# Altium schematic sheet con-left-top.SchDoc: CS - Left Top
size Letter; CheckedBy: J. Brinton; CompanyName: Signal Laboratories, Inc.; DrawnBy: J. Brinton; Engineer: J. Brinton; Address1: 3479 Edison Way; Address2: Menlo Park CA 94025; Address3: +1 (877) 778-8435; Address4: siglabs.com; Revision: 3; SheetNumber: 33; SheetTotal: 47
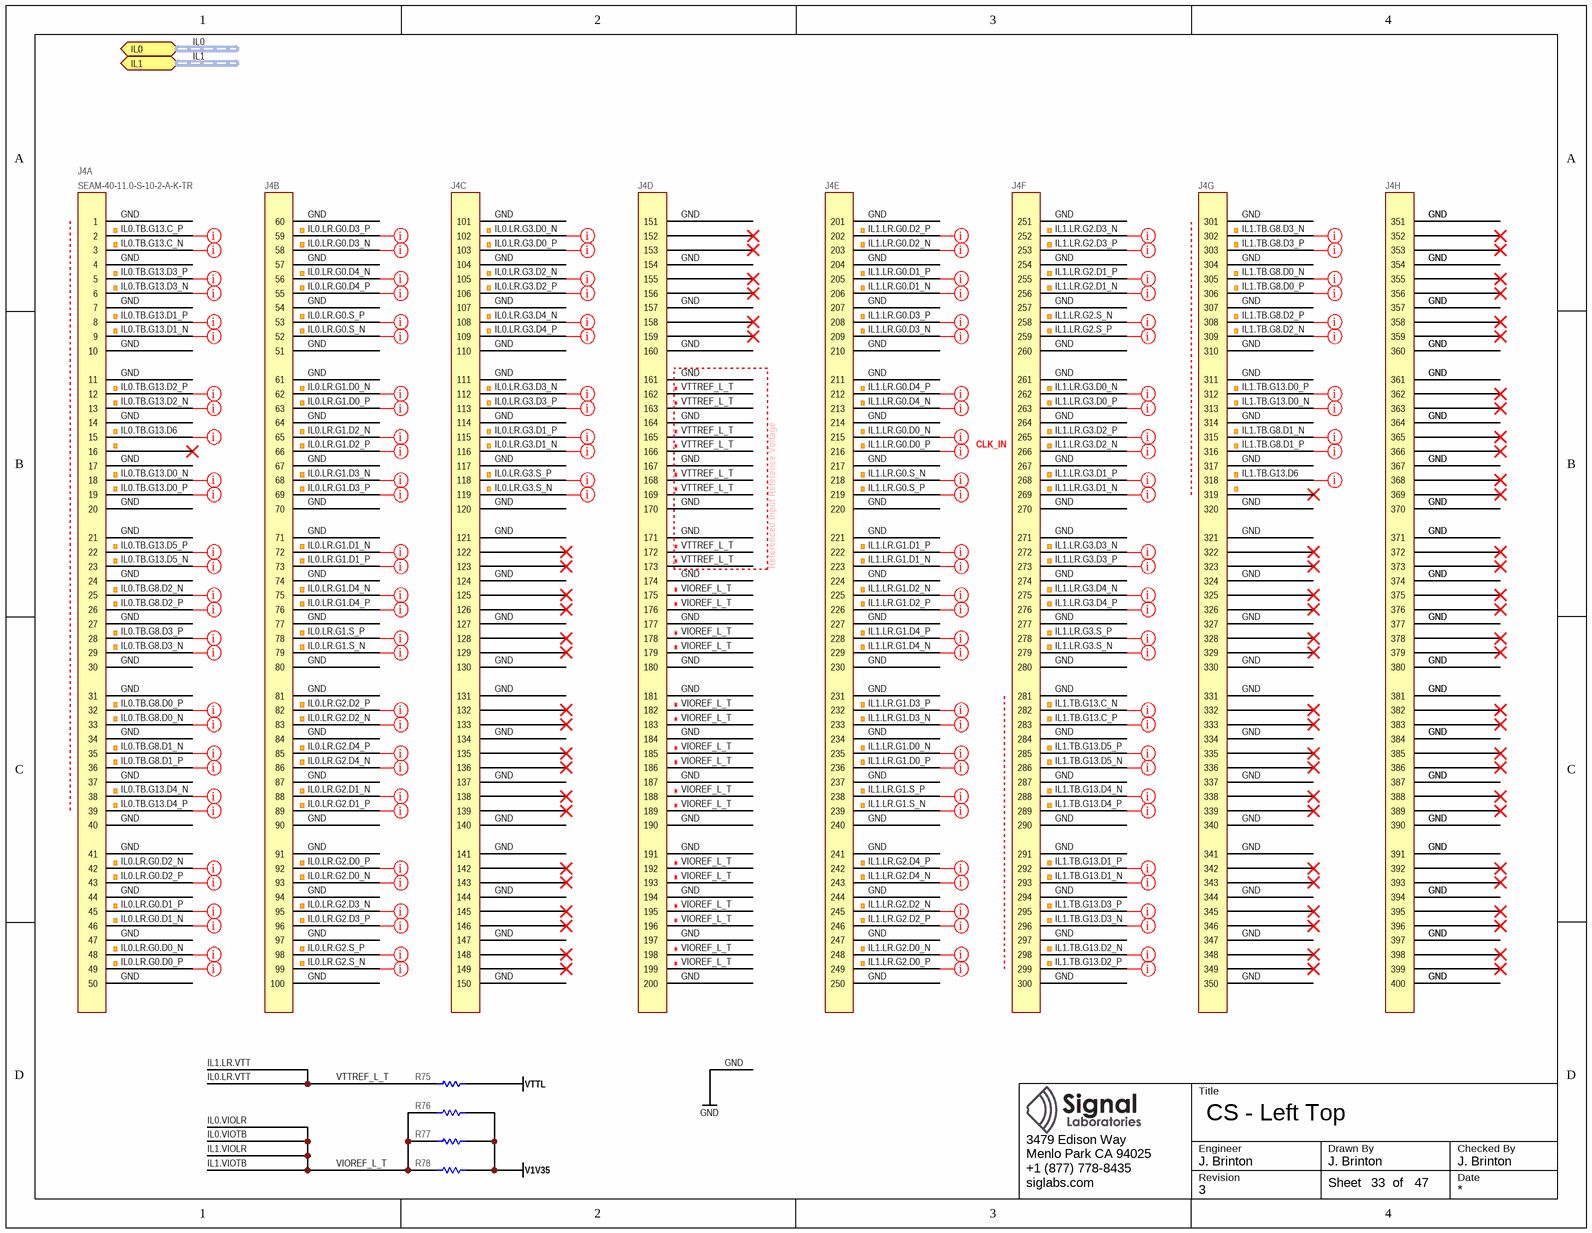
[diagram p0: con-left-top.SchDoc]

## Parts
J4  SEAM-40-11.0-S-10-2-A-K-TR  [SEAM-40-11.0-S-10-2-A-K-TR]  (parts A,B,C,D,E,F,G,H of 8)
R75  SOLDER_LINK  [SOLDERLINK0603X26N]  (value not drawn)  (no BOM)
R76  SOLDER_LINK  [SOLDERLINK0603X26N]  (value not drawn)  (no BOM)
R77  SOLDER_LINK  [SOLDERLINK0603X26N]  (value not drawn)  (no BOM)
R78  SOLDER_LINK  [SOLDERLINK0603X26N]  (value not drawn)  (no BOM)

## Ports
IL0 (harness IL), IL1 (harness IL)

## Nets
GND: J4.1 J4.4 J4.7 J4.10 J4.11 J4.14 J4.17 J4.20 J4.21 J4.24 J4.27 J4.30 J4.31 J4.34 J4.37 J4.40 J4.41 J4.44 J4.47 J4.50 J4.51 J4.54 J4.57 J4.60 J4.61 J4.64 J4.67 J4.70 J4.71 J4.74 J4.77 J4.80 J4.81 J4.84 J4.87 J4.90 J4.91 J4.94 J4.97 J4.100 J4.101 J4.104 J4.107 J4.110 J4.111 J4.114 J4.117 J4.120 J4.121 J4.124 J4.127 J4.130 J4.131 J4.134 J4.137 J4.140 J4.141 J4.144 J4.147 J4.150 J4.151 J4.154 J4.157 J4.160 J4.161 J4.164 J4.167 J4.170 J4.171 J4.174 J4.177 J4.180 J4.181 J4.184 J4.187 J4.190 J4.191 J4.194 J4.197 J4.200 J4.201 J4.204 J4.207 J4.210 J4.211 J4.214 J4.217 J4.220 J4.221 J4.224 J4.227 J4.230 J4.231 J4.234 J4.237 J4.240 J4.241 J4.244 J4.247 J4.250 J4.251 J4.254 J4.257 J4.260 J4.261 J4.264 J4.267 J4.270 J4.271 J4.274 J4.277 J4.280 J4.281 J4.284 J4.287 J4.290 J4.291 J4.294 J4.297 J4.300 J4.301 J4.304 J4.307 J4.310 J4.311 J4.314 J4.317 J4.320 J4.321 J4.324 J4.327 J4.330 J4.331 J4.334 J4.337 J4.340 J4.341 J4.344 J4.347 J4.350 J4.351 J4.354 J4.357 J4.360 J4.361 J4.364 J4.367 J4.370 J4.371 J4.374 J4.377 J4.380 J4.381 J4.384 J4.387 J4.390 J4.391 J4.394 J4.397 J4.400
V1V35: R76.1 R77.1 R78.1
VTTL: R75.1
IL0.LR.G0.D0_N: J4.48
IL0.LR.G0.D0_P: J4.49
IL0.LR.G0.D1_N: J4.46
IL0.LR.G0.D1_P: J4.45
IL0.LR.G0.D2_N: J4.42
IL0.LR.G0.D2_P: J4.43
IL0.LR.G0.D3_N: J4.58
IL0.LR.G0.D3_P: J4.59
IL0.LR.G0.D4_N: J4.56
IL0.LR.G0.D4_P: J4.55
IL0.LR.G0.S_N: J4.52
IL0.LR.G0.S_P: J4.53
IL0.LR.G1.D0_N: J4.62
IL0.LR.G1.D0_P: J4.63
IL0.LR.G1.D1_N: J4.72
IL0.LR.G1.D1_P: J4.73
IL0.LR.G1.D2_N: J4.65
IL0.LR.G1.D2_P: J4.66
IL0.LR.G1.D3_N: J4.68
IL0.LR.G1.D3_P: J4.69
IL0.LR.G1.D4_N: J4.75
IL0.LR.G1.D4_P: J4.76
IL0.LR.G1.S_N: J4.79
IL0.LR.G1.S_P: J4.78
IL0.LR.G2.D0_N: J4.93
IL0.LR.G2.D0_P: J4.92
IL0.LR.G2.D1_N: J4.88
IL0.LR.G2.D1_P: J4.89
IL0.LR.G2.D2_N: J4.83
IL0.LR.G2.D2_P: J4.82
IL0.LR.G2.D3_N: J4.95
IL0.LR.G2.D3_P: J4.96
IL0.LR.G2.D4_N: J4.86
IL0.LR.G2.D4_P: J4.85
IL0.LR.G2.S_N: J4.99
IL0.LR.G2.S_P: J4.98
IL0.LR.G3.D0_N: J4.102
IL0.LR.G3.D0_P: J4.103
IL0.LR.G3.D1_N: J4.116
IL0.LR.G3.D1_P: J4.115
IL0.LR.G3.D2_N: J4.105
IL0.LR.G3.D2_P: J4.106
IL0.LR.G3.D3_N: J4.112
IL0.LR.G3.D3_P: J4.113
IL0.LR.G3.D4_N: J4.108
IL0.LR.G3.D4_P: J4.109
IL0.LR.G3.S_N: J4.119
IL0.LR.G3.S_P: J4.118
IL0.LR.VTT: J4.162 J4.163 J4.165 J4.166 J4.168 J4.169 J4.172 J4.173 R75.2  [also labelled IL1.LR.VTT, VTTREF_L_T]
IL0.TB.G8.D0_N: J4.33
IL0.TB.G8.D0_P: J4.32
IL0.TB.G8.D1_N: J4.35
IL0.TB.G8.D1_P: J4.36
IL0.TB.G8.D2_N: J4.25
IL0.TB.G8.D2_P: J4.26
IL0.TB.G8.D3_N: J4.29
IL0.TB.G8.D3_P: J4.28
IL0.TB.G13.C_N: J4.3
IL0.TB.G13.C_P: J4.2
IL0.TB.G13.D0_N: J4.18
IL0.TB.G13.D0_P: J4.19
IL0.TB.G13.D1_N: J4.9
IL0.TB.G13.D1_P: J4.8
IL0.TB.G13.D2_N: J4.13
IL0.TB.G13.D2_P: J4.12
IL0.TB.G13.D3_N: J4.6
IL0.TB.G13.D3_P: J4.5
IL0.TB.G13.D4_N: J4.38
IL0.TB.G13.D4_P: J4.39
IL0.TB.G13.D5_N: J4.23
IL0.TB.G13.D5_P: J4.22
IL0.TB.G13.D6: J4.15
IL0.VIOLR: J4.175 J4.176 J4.178 J4.179 J4.182 J4.183 J4.185 J4.186 J4.188 J4.189 J4.192 J4.193 J4.195 J4.196 J4.198 J4.199 R76.2 R77.2 R78.2  [also labelled IL0.VIOTB, IL1.VIOLR, IL1.VIOTB, VIOREF_L_T]
IL1.LR.G0.D0_N: J4.215
IL1.LR.G0.D0_P: J4.216
IL1.LR.G0.D1_N: J4.206
IL1.LR.G0.D1_P: J4.205
IL1.LR.G0.D2_N: J4.203
IL1.LR.G0.D2_P: J4.202
IL1.LR.G0.D3_N: J4.209
IL1.LR.G0.D3_P: J4.208
IL1.LR.G0.D4_N: J4.213
IL1.LR.G0.D4_P: J4.212
IL1.LR.G0.S_N: J4.218
IL1.LR.G0.S_P: J4.219
IL1.LR.G1.D0_N: J4.235
IL1.LR.G1.D0_P: J4.236
IL1.LR.G1.D1_N: J4.223
IL1.LR.G1.D1_P: J4.222
IL1.LR.G1.D2_N: J4.225
IL1.LR.G1.D2_P: J4.226
IL1.LR.G1.D3_N: J4.233
IL1.LR.G1.D3_P: J4.232
IL1.LR.G1.D4_N: J4.229
IL1.LR.G1.D4_P: J4.228
IL1.LR.G1.S_N: J4.239
IL1.LR.G1.S_P: J4.238
IL1.LR.G2.D0_N: J4.248
IL1.LR.G2.D0_P: J4.249
IL1.LR.G2.D1_N: J4.256
IL1.LR.G2.D1_P: J4.255
IL1.LR.G2.D2_N: J4.245
IL1.LR.G2.D2_P: J4.246
IL1.LR.G2.D3_N: J4.252
IL1.LR.G2.D3_P: J4.253
IL1.LR.G2.D4_N: J4.243
IL1.LR.G2.D4_P: J4.242
IL1.LR.G2.S_N: J4.258
IL1.LR.G2.S_P: J4.259
IL1.LR.G3.D0_N: J4.262
IL1.LR.G3.D0_P: J4.263
IL1.LR.G3.D1_N: J4.269
IL1.LR.G3.D1_P: J4.268
IL1.LR.G3.D2_N: J4.266
IL1.LR.G3.D2_P: J4.265
IL1.LR.G3.D3_N: J4.272
IL1.LR.G3.D3_P: J4.273
IL1.LR.G3.D4_N: J4.275
IL1.LR.G3.D4_P: J4.276
IL1.LR.G3.S_N: J4.279
IL1.LR.G3.S_P: J4.278
IL1.TB.G8.D0_N: J4.305
IL1.TB.G8.D0_P: J4.306
IL1.TB.G8.D1_N: J4.315
IL1.TB.G8.D1_P: J4.316
IL1.TB.G8.D2_N: J4.309
IL1.TB.G8.D2_P: J4.308
IL1.TB.G8.D3_N: J4.302
IL1.TB.G8.D3_P: J4.303
IL1.TB.G13.C_N: J4.282
IL1.TB.G13.C_P: J4.283
IL1.TB.G13.D0_N: J4.313
IL1.TB.G13.D0_P: J4.312
IL1.TB.G13.D1_N: J4.293
IL1.TB.G13.D1_P: J4.292
IL1.TB.G13.D2_N: J4.298
IL1.TB.G13.D2_P: J4.299
IL1.TB.G13.D3_N: J4.296
IL1.TB.G13.D3_P: J4.295
IL1.TB.G13.D4_N: J4.288
IL1.TB.G13.D4_P: J4.289
IL1.TB.G13.D5_N: J4.286
IL1.TB.G13.D5_P: J4.285
IL1.TB.G13.D6: J4.318

Not connected (* = marked no-connect by the designer): J4 16* 122* 123* 125* 126* 128* 129* 132* 133* 135* 136* 138* 139* 142* 143* 145* 146* 148* 149* 152* 153* 155* 156* 158* 159* 319* 322* 323* 325* 326* 328* 329* 332* 333* 335* 336* 338* 339* 342* 343* 345* 346* 348* 349* 352* 353* 355* 356* 358* 359* 362* 363* 365* 366* 368* 369* 372* 373* 375* 376* 378* 379* 382* 383* 385* 386* 388* 389* 392* 393* 395* 396* 398* 399*

## Buses and harness runs
harness IL0 = port IL0
harness IL1 = port IL1

## Layout directives
net class z50; differential pair; net class loose: IL0.LR.G0.D0_N, IL0.LR.G0.D0_P, IL0.LR.G0.D1_N, IL0.LR.G0.D1_P, IL0.LR.G0.D2_N, IL0.LR.G0.D2_P, IL0.LR.G0.D3_N, IL0.LR.G0.D3_P, IL0.LR.G0.D4_N, IL0.LR.G0.D4_P, IL0.LR.G0.S_N, IL0.LR.G0.S_P, IL0.LR.G1.D0_N, IL0.LR.G1.D0_P, IL0.LR.G1.D1_N, IL0.LR.G1.D1_P, IL0.LR.G1.D2_N, IL0.LR.G1.D2_P, IL0.LR.G1.D3_N, IL0.LR.G1.D3_P, IL0.LR.G1.D4_N, IL0.LR.G1.D4_P, IL0.LR.G1.S_N, IL0.LR.G1.S_P, IL0.LR.G2.D0_N, IL0.LR.G2.D0_P, IL0.LR.G2.D1_N, IL0.LR.G2.D1_P, IL0.LR.G2.D2_N, IL0.LR.G2.D2_P, IL0.LR.G2.D3_N, IL0.LR.G2.D3_P, IL0.LR.G2.D4_N, IL0.LR.G2.D4_P, IL0.LR.G2.S_N, IL0.LR.G2.S_P, IL0.LR.G3.D0_N, IL0.LR.G3.D0_P, IL0.LR.G3.D1_N, IL0.LR.G3.D1_P, IL0.LR.G3.D2_N, IL0.LR.G3.D2_P, IL0.LR.G3.D3_N, IL0.LR.G3.D3_P, IL0.LR.G3.D4_N, IL0.LR.G3.D4_P, IL0.LR.G3.S_N, IL0.LR.G3.S_P, IL0.TB.G8.D0_N, IL0.TB.G8.D0_P, IL0.TB.G8.D1_N, IL0.TB.G8.D1_P, IL0.TB.G8.D2_N, IL0.TB.G8.D2_P, IL0.TB.G8.D3_N, IL0.TB.G8.D3_P, IL0.TB.G13.C_N, IL0.TB.G13.C_P, IL0.TB.G13.D0_N, IL0.TB.G13.D0_P, IL0.TB.G13.D1_N, IL0.TB.G13.D1_P, IL0.TB.G13.D2_N, IL0.TB.G13.D2_P, IL0.TB.G13.D3_N, IL0.TB.G13.D3_P, IL0.TB.G13.D4_N, IL0.TB.G13.D4_P, IL0.TB.G13.D5_N, IL0.TB.G13.D5_P, IL1.LR.G0.D0_N, IL1.LR.G0.D0_P, IL1.LR.G0.D1_N, IL1.LR.G0.D1_P, IL1.LR.G0.D2_N, IL1.LR.G0.D2_P, IL1.LR.G0.D3_N, IL1.LR.G0.D3_P, IL1.LR.G0.D4_N, IL1.LR.G0.D4_P, IL1.LR.G0.S_N, IL1.LR.G0.S_P, IL1.LR.G1.D0_N, IL1.LR.G1.D0_P, IL1.LR.G1.D1_N, IL1.LR.G1.D1_P, IL1.LR.G1.D2_N, IL1.LR.G1.D2_P, IL1.LR.G1.D3_N, IL1.LR.G1.D3_P, IL1.LR.G1.D4_N, IL1.LR.G1.D4_P, IL1.LR.G1.S_N, IL1.LR.G1.S_P, IL1.LR.G2.D0_N, IL1.LR.G2.D0_P, IL1.LR.G2.D1_N, IL1.LR.G2.D1_P, IL1.LR.G2.D2_N, IL1.LR.G2.D2_P, IL1.LR.G2.D3_N, IL1.LR.G2.D3_P, IL1.LR.G2.D4_N, IL1.LR.G2.D4_P, IL1.LR.G2.S_N, IL1.LR.G2.S_P, IL1.LR.G3.D0_N, IL1.LR.G3.D0_P, IL1.LR.G3.D1_N, IL1.LR.G3.D1_P, IL1.LR.G3.D2_N, IL1.LR.G3.D2_P, IL1.LR.G3.D3_N, IL1.LR.G3.D3_P, IL1.LR.G3.D4_N, IL1.LR.G3.D4_P, IL1.LR.G3.S_N, IL1.LR.G3.S_P, IL1.TB.G8.D0_N, IL1.TB.G8.D0_P, IL1.TB.G8.D1_N, IL1.TB.G8.D1_P, IL1.TB.G8.D2_N, IL1.TB.G8.D2_P, IL1.TB.G8.D3_N, IL1.TB.G8.D3_P, IL1.TB.G13.C_N, IL1.TB.G13.C_P, IL1.TB.G13.D0_N, IL1.TB.G13.D0_P, IL1.TB.G13.D1_N, IL1.TB.G13.D1_P, IL1.TB.G13.D2_N, IL1.TB.G13.D2_P, IL1.TB.G13.D3_N, IL1.TB.G13.D3_P, IL1.TB.G13.D4_N, IL1.TB.G13.D4_P, IL1.TB.G13.D5_N, IL1.TB.G13.D5_P
net class z50: IL0.TB.G13.D6, IL1.TB.G13.D6

## Notes on the sheet
- (near J4) CLK_IN
- Referenced Input Reference Voltage
- Title
- Engineer
- Revision
- Drawn By
- Checked By
- Date
- Sheet
- of

## Library data of the parts
J4 = SEAM-40-11.0-S-10-2-A-K-TR: Terminal Array Assembly, Surface Mount, 0.050" Pitch, 400 Pins; Manufacturer: Samtec; Manufacturer P/N: SEAM-40-11.0-S-10-2-A-K-TR
R75-R78 = RES: Solder Link; Manufacturer P/N: *; Manufacturer: *